# Altium schematic sheet STC12C5A60S2-35I1_STC12C5A60S2-35I.schdoc
size 127 x 99 mm
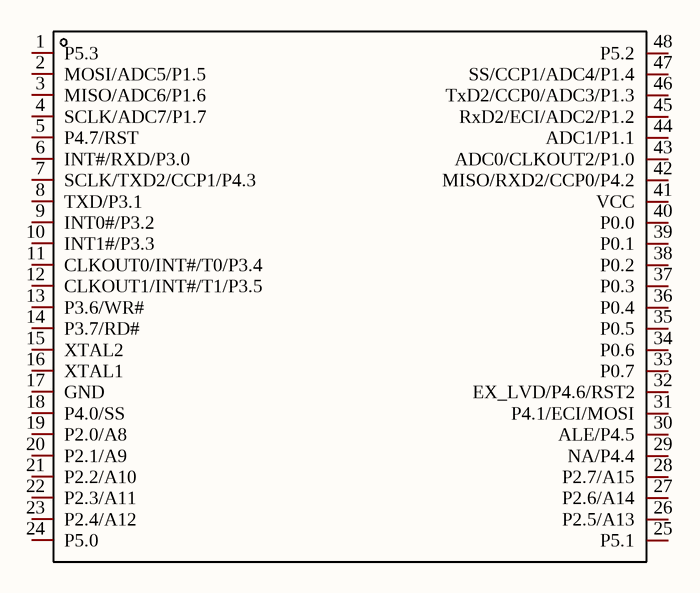
[diagram p0: STC12C5A60S2-35I1_STC12C5A60S2-35I.schdoc]

## Parts
U?  STC12C5A60S2-35I-LQFP48  [LQFP-48_L7.0-W7.0-P0.50-LS9.0-BL]  (value not drawn)

## Nets

Not connected (* = marked no-connect by the designer): U? 1(P5.3) 2(MOSI/ADC5/P1.5) 3(MISO/ADC6/P1.6) 4(SCLK/ADC7/P1.7) 5(P4.7/RST) 6(INT#/RXD/P3.0) 7(SCLK/TXD2/CCP1/P4.3) 8(TXD/P3.1) 9(INT0#/P3.2) 10(INT1#/P3.3) 11(CLKOUT0/INT#/T0/P3.4) 12(CLKOUT1/INT#/T1/P3.5) 13(P3.6/WR#) 14(P3.7/RD#) 15(XTAL2) 16(XTAL1) 17(GND) 18(P4.0/SS) 19(P2.0/A8) 20(P2.1/A9) 21(P2.2/A10) 22(P2.3/A11) 23(P2.4/A12) 24(P5.0) 25(P5.1) 26(P2.5/A13) 27(P2.6/A14) 28(P2.7/A15) 29(NA/P4.4) 30(ALE/P4.5) 31(P4.1/ECI/MOSI) 32(EX_LVD/P4.6/RST2) 33(P0.7) 34(P0.6) 35(P0.5) 36(P0.4) 37(P0.3) 38(P0.2) 39(P0.1) 40(P0.0) 41(VCC) 42(MISO/RXD2/CCP0/P4.2) 43(ADC0/CLKOUT2/P1.0) 44(ADC1/P1.1) 45(RxD2/ECI/ADC2/P1.2) 46(TxD2/CCP0/ADC3/P1.3) 47(SS/CCP1/ADC4/P1.4) 48(P5.2)

## Library data of the parts
U? = STC12C5A60S2-35I-LQFP48: Manufacturer: STC(宏晶); Add into BOM: yes; CPU Core: 51系列; CPU Maximum Speed: 35MHz; Operating Voltage Range: 4V~5.5V; Program Storage Size: 60KB; Program Memory Type: FLASH; RAM Size: 1.25KB; GPIO Ports Number: 44; ADC (Bit): 10bit; 16Bit Timer: 2; SPI: 1; Peripheral/Function: 低电压检测；看门狗；CCP捕获/比较; Watchdog: 有; Name: STC12C5A60S2-35I-LQFP48; Symbol: STC12C5A60S2-35I; Device: STC12C5A60S2-35I-LQFP48; LCSC Part Name: 51系列 35MHz; Supplier Part: C8695; Manufacturer Part: STC12C5A60S2-35I-LQFP48; Supplier Footprint: LQFP-48(7x7); JLCPCB Part Class: Extended Part; Datasheet: https://atta.szlcsc.com/upload/public/pdf/source/20120808/1457706522369.pdf; Supplier: LCSC; Convert to PCB: yes; EEPROM: -; DAC (Bit): -; PWM (Bit): -; 8Bit Timer: -; 32Bit Timer: -; CAN: -; UART/USART: 2; I2C: -; I2S: -; Universal Serial Bus: -; Internal Comparator: -; communication protocol: -; Real-Time Clock: -; Infrared Data Association: -; Low-Voltage Detect: 有; CCP Capture/Compare: 有; Secure Digital Input and Output: -; Direct Memory Access: -; Internal Oscillator: 有; Operating Temperature Range: -40℃~+85℃